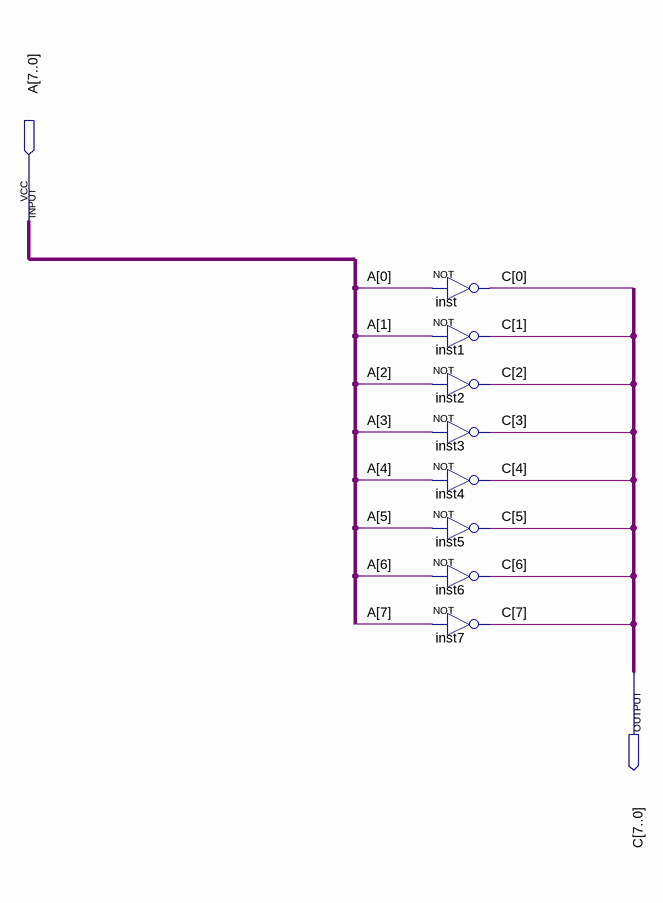
[diagram p0: schematic sheet]
// Quartus schematic not8.bdf as structural Verilog: 8 symbols, 2 pins
module not8 (
  input  [7:0] A,
  output [7:0] C
);

  not inst (C[0], A[0]);
  not inst1 (C[1], A[1]);
  not inst2 (C[2], A[2]);
  not inst3 (C[3], A[3]);
  not inst4 (C[4], A[4]);
  not inst5 (C[5], A[5]);
  not inst6 (C[6], A[6]);
  not inst7 (C[7], A[7]);
endmodule
